# Altium schematic sheet EIT_Teensy_DDS.SchDoc
size A
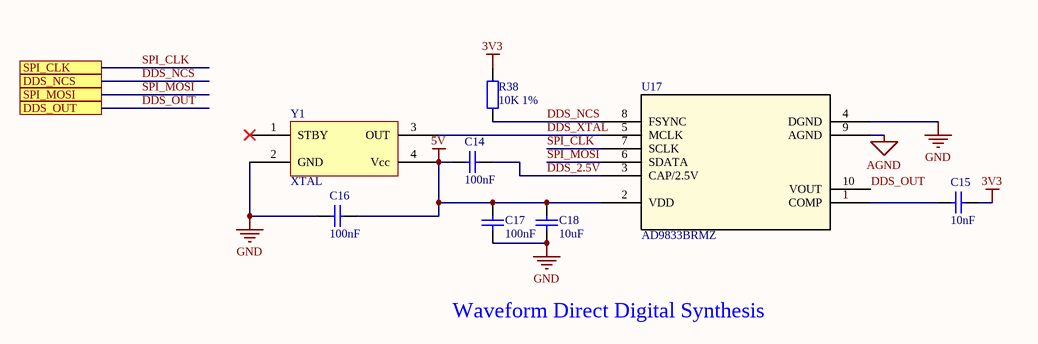
[diagram p0: EIT_Teensy_DDS.SchDoc]

## Parts
C14  100nF  [0603 CAP]
C15  10nF  [0603 CAP]
C16  100nF  [0603 CAP]
C17  100nF  [0603 CAP]
C18  10uF  [0603 CAP]
R38  10K 1%  [0603 RES]
U17  AD9833BRMZ  [RM_10_ADI]
Y1  XTAL  [XTAL SMD]

## Ports
DDS_NCS, DDS_OUT, SPI_CLK, SPI_MOSI

## Nets
3V3: C15.2 R38.2
5V: C14.1 C16.1 C17.2 C18.2 U17.2(VDD) Y1.4(Vcc)
AGND: U17.9(AGND)
GND: C16.2 C17.1 C18.1 U17.4(DGND) Y1.2(GND)
DDS_2.5V: C14.2 U17.3(CAP/2.5V)
DDS_NCS: R38.1 U17.8(FSYNC) ; port DDS_NCS
DDS_OUT: U17.10(VOUT) ; port DDS_OUT
DDS_XTAL: U17.5(MCLK) Y1.3(OUT)
SPI_CLK: U17.7(SCLK) ; port SPI_CLK
SPI_MOSI: U17.6(SDATA) ; port SPI_MOSI
NetC15_1: C15.1 U17.1(COMP)

Not connected (* = marked no-connect by the designer): Y1 1(STBY)*

## Notes on the sheet
- Waveform Direct Digital Synthesis

## Library data of the parts
C14 C16 C17 = Cap 0603 100nF 10% 50V: Multi Layer Ceramic Capacitor (MLCC) / Cap Ceramic 0.1uF 50V X7R 10% Pad SMD 0603 125¡ãC T/R; Manufacturer: Samsung; Manufacturer Part Number: CL10B104KB8NNNC; Supplier 1: Digi-Key; RoHS: Yes; Category: Ceramic Capacitors; Stock 1: 16186368; Pricing 1: 1=0.10000, 10=0.03000, 50=0.01620, 100=0.01330, 500=0.00950, 1000=0.00746 (USD); Mount: Surface Mount; Case/Package: 0603; Case Code (Metric): 1608; Case Code (Imperial): 0603; Material: Ceramic; Contact Plating: Tin; Min Operating Temperature: -55°C; Max Operating Temperature: 125°C; Tolerance: 10%; Package Quantity: 1; Packaging: Tape and Reel; Capacitance: 100nF; Dielectric: X7R; Series: CL; Voltage Rating: 50V; Voltage: 50V; Voltage Rating (DC): 50V; Construction: Flat; Length: 1.6mm; Width: 0.031inch; Height: 0.8mm; Depth: 0.8mm; Thickness: 0.035inch; Radiation Hardening: No; Lead Free: Lead Free; RoHS Compliant: Yes; ComponentLink1URL: https://datasheet.ciiva.com/25803/cl10b104kb8nnnc-25803393.pdf?src-supplier=Digi-Key; ComponentLink1Description: https://datasheet.ciiva.com/25803/cl10b104kb8nnnc-25803393.pdf?src-supplier=Digi-Key; ComponentLink2URL: https://datasheet.ciiva.com/26838/getdatasheetpartid-89097-26838411.pdf?src-supplier=Verical; ComponentLink2Description: https://datasheet.ciiva.com/26838/getdatasheetpartid-89097-26838411.pdf?src-supplier=Verical; ComponentLink3URL: https://datasheet.ciiva.com/29198/456651-da-01-en-vs-kondensator-0605-29198839.pdf?src-supplier=Conrad; ComponentLink3Description: https://datasheet.ciiva.com/29198/456651-da-01-en-vs-kondensator-0605-29198839.pdf?src-supplier=Conrad; Supplier Part Number 1: 1276-1000-1-ND
C15 = Cap 0603 10nF 10% 50V: CAP CER 10000PF 50V X7R 0603; Manufacturer: Samsung; Manufacturer Part Number: CL10B103KB8NFNC; Tolerance: 10%; Supplier 1: Digi-Key; RoHS: Yes; Category: Ceramic Capacitors; Stock 1: 172215; Pricing 1: 1=0.10000, 10=0.03700, 50=0.02020, 100=0.01650, 500=0.01176, 1000=0.00923 (USD); Mount: Surface Mount; Case/Package: 0603; Case Code (Metric): 1608; Case Code (Imperial): 0603; Contact Plating: Tin,Matte; Min Operating Temperature: -55°C; Max Operating Temperature: 125°C; Capacitance: 10nF; Dielectric: X7R; Voltage Rating: 50V; Packaging: Tape and Reel; Series: CL; Construction: Flat; Length: 0.063inch; Width: 0.031inch; Height: 0.8mm; Depth: 0.8mm; Thickness: 0.035inch; Radiation Hardening: No; ComponentLink1URL: https://datasheet.ciiva.com/25712/cl10b103kb8nfnc-25712209.pdf?src-supplier=Digi-Key; ComponentLink1Description: https://datasheet.ciiva.com/25712/cl10b103kb8nfnc-25712209.pdf?src-supplier=Digi-Key; Supplier Part Number 1: 1276-1922-1-ND; RoHS Compliant: Yes
C18 = Cap 0603 10uF 10% 25V: 0603 10 uF 25 V ±20 % Tolerance X5R Surface Mount Multilayer Ceramic Capacitor; Manufacturer: Murata; Manufacturer Part Number: GRT188R61E106ME13D; Voltage Rating: 25V; Tolerance: 20%; Supplier 1: Digi-Key; RoHS: No; Category: Ceramic Capacitors; Stock 1: 290939; Pricing 1: 1=0.53000, 10=0.36700, 50=0.25660, 100=0.22000, 500=0.16498, 1000=0.13932 (USD); Case/Package: 0603; RoHS Compliant: No; ComponentLink1URL: https://search.murata.co.jp/Ceramy/image/img/A01X/G101/ENG/GRT188R61E106ME13-01.pdf?src-supplier=Digi-Key; ComponentLink1Description: https://search.murata.co.jp/Ceramy/image/img/A01X/G101/ENG/GRT188R61E106ME13-01.pdf?src-supplier=Digi-Key; Supplier Part Number 1: 490-12323-1-ND; Mount: Surface Mount; Case Code (Metric): 1608; Case Code (Imperial): 0603; Min Operating Temperature: -55°C; Max Operating Temperature: 85°C; Packaging: Tape and Reel; Capacitance: 10uF; Length: 0.063inch; Width: 0.031inch; Thickness: 0.035inch; Ratings: AEC-Q200; ComponentLink2URL: http://search.murata.co.jp/Ceramy/image/img/A01X/G101/ENG/GRT188R61E106ME13-01.pdf?src-supplier=Digi-Key; ComponentLink2Description: http://search.murata.co.jp/Ceramy/image/img/A01X/G101/ENG/GRT188R61E106ME13-01.pdf?src-supplier=Digi-Key
R38 = Res 0603 10K 1%: Res General Purpose Thick Film 0603 10K Ohm 1% 1/10W ±100ppm/°C Molded SMD Paper T/R; Manufacturer: Yageo; Manufacturer Part Number: RC0603FR-0710KL; Voltage Rating: 75V; Resistance: 10kR; Power Rating: 100mW; Voltage Rating (DC): 50V; Supplier 1: Digi-Key; RoHS: Yes; Category: Chip SMD Resistors; Stock 1: 18430741; Pricing 1: 1=0.10000, 10=0.02400, 100=0.00970, 1000=0.00436, 2500=0.00378 (USD); Case/Package: 0603; Number of Pins: 2; Case Code (Imperial): 0603; Case Code (Metric): 1608; Size Code: 0603; Weight: 7.1E-05oz; Min Operating Temperature: -55°C; Max Operating Temperature: 155°C; Packaging: Tape and Reel; Tolerance: 1%; Termination: SMD/SMT; Resistor Type: Thick Film; Temperature Coefficient: 100ppm/°C; Features: Moisture Resistant; Series: RC; Max Power Dissipation: 100mW; Number of Terminations: 2; Resistance Tolerance: 1%; Construction: Rectangular; Length: 1.6mm; Width: 0.8mm; Height: 0.45mm; Depth: 0.8mm; Lead Pitch: 0.3mm; REACH SVHC: Unknown; Military Standard: Not; Lead Free: Lead Free; RoHS Compliant: Yes; ComponentLink1URL: https://datasheet.ciiva.com/15189/getdatasheetpartid-409289-15189591.pdf?src-supplier=Verical; ComponentLink1Description: https://datasheet.ciiva.com/15189/getdatasheetpartid-409289-15189591.pdf?src-supplier=Verical; ComponentLink2URL: https://datasheet.ciiva.com/7660/38590-7660789.pdf?src-supplier=Element14; ComponentLink2Description: https://datasheet.ciiva.com/7660/38590-7660789.pdf?src-supplier=Element14; ComponentLink3URL: https://datasheet.ciiva.com/7746/1738695-7746239.pdf?src-supplier=Element14; ComponentLink3Description: https://datasheet.ciiva.com/7746/1738695-7746239.pdf?src-supplier=Element14; ComponentLink4URL: https://datasheet.ciiva.com/7983/443971-7983596.pdf?src-supplier=Element14; ComponentLink4Description: https://datasheet.ciiva.com/7983/443971-7983596.pdf?src-supplier=Element14; ComponentLink5URL: https://datasheet.ciiva.com/22747/443971-22747519.pdf?src-supplier=Element14; ComponentLink5Description: https://datasheet.ciiva.com/22747/443971-22747519.pdf?src-supplier=Element14; ComponentLink6URL: https://datasheet.ciiva.com/46440/1868787-46440891.pdf?src-supplier=Element14; ComponentLink6Description: https://datasheet.ciiva.com/46440/1868787-46440891.pdf?src-supplier=Element14; Supplier Part Number 1: 311-10.0KHRCT-ND
U17 = AD9833BRMZ: Direct Digital Synthesizer 25MHz 1-DAC 10-Bit Serial 10-Pin MSOP T/R; Manufacturer: Analog Devices; Manufacturer Part Number: AD9833BRMZ-REEL; Min Supply Voltage: 2.3V; Max Supply Voltage: 5.5V; Resolution: 10b; Number of Converters: 1; Signal to Noise Ratio (SNR): 60dB; Power Dissipation: 27.5mW; Nominal Supply Current: 5.5mA; Number of Bits: 10; Nominal Output Voltage: 650mV; Output Type: Voltage; Supplier 1: Digi-Key; RoHS: Yes; Category: Integrated Circuits (ICs); Stock 1: 963; Pricing 1: 1=10.65000, 10=9.61700, 25=9.17000, 100=7.96230, 250=7.60444, 500=6.93346, 1000=6.33000 (USD); Mount: Surface Mount; Case/Package: MSOP; Number of Pins: 10; Contact Plating: Tin,Matte; Min Operating Temperature: -40°C; Max Operating Temperature: 105°C; Packaging: Tape and Reel; Package Quantity: 3000; Number of Outputs: 1; Number of D/A Converters: 1; Max Supply Current: 5.5mA; Frequency: 25MHz; Operating Supply Current: 5.5mA; Series: -; Lead Free: Contains Lead; RoHS Compliant: Yes; ComponentLink1URL: https://datasheet.ciiva.com/26828/ad9833brmz-reel-26828130.pdf?src-supplier=IIIC; ComponentLink1Description: https://datasheet.ciiva.com/26828/ad9833brmz-reel-26828130.pdf?src-supplier=IIIC; ComponentLink2URL: https://datasheet.ciiva.com/3177/ad9833-3177366.pdf?src-supplier=Avnet; ComponentLink2Description: https://datasheet.ciiva.com/3177/ad9833-3177366.pdf?src-supplier=Avnet; ComponentLink3URL: https://datasheet.ciiva.com/25889/ad9833-25889575.pdf?src-supplier=Avnet+Europe; ComponentLink3Description: https://datasheet.ciiva.com/25889/ad9833-25889575.pdf?src-supplier=Avnet+Europe; Supplier Part Number 1: AD9833BRMZ-REELCT-ND
Y1 = XTAL 16MHz 5V SMD: CRYSTAL, 16MHZ, 18PF, 5 X 3.2MM; Product Range:ABM3B Series; Frequency Nom:16MHz; Frequency Stability + / -:50ppm; Frequency Tolerance + / -:20ppm; Crystal Case:SMD, 5mm x 3.2mm; Load Capacitance:18pF; Operating Temperature Min:-20 C;RoHS Compliant: Yes; Manufacturer: Abracon; Manufacturer Part Number: ABM3B-16.000MHZ-B2-T; ESR (Equivalent Series Resistance): 50R; Tolerance: 20ppm; Frequency Stability: 50ppm; Supplier 1: Digi-Key; RoHS: Yes; Category: Crystals; Stock 1: 37377; Pricing 1: 1=0.95000, 10=0.83900, 50=0.78440, 100=0.69310, 500=0.65664 (USD); Mount: Surface Mount; Case/Package: CSMD; Number of Pins: 4; Min Operating Temperature: -20°C; Max Operating Temperature: 70°C; Frequency: 16MHz; Load Capacitance: 18pF; Packaging: Tape and Reel; Package Quantity: 1000; Frequency Tolerance: 20ppm; Termination: SMD/SMT; Resistor Type: Ceramic; Accuracy: 20ppm; Series: ABM3B; Operating Frequency: 16 MHz; Length: 5mm; Width: 3.2mm; Height: 0.043inch; Depth: 3.2mm; REACH SVHC: No SVHC; Lead Free: Lead Free; ComponentLink1URL: https://datasheet.ciiva.com/855/abm3b-855719.pdf?src-supplier=Digi-Key; ComponentLink1Description: https://datasheet.ciiva.com/855/abm3b-855719.pdf?src-supplier=Digi-Key; ComponentLink2URL: https://datasheet.ciiva.com/855/abm3b-855720.pdf?src-supplier=Digi-Key; ComponentLink2Description: https://datasheet.ciiva.com/855/abm3b-855720.pdf?src-supplier=Digi-Key; ComponentLink3URL: https://datasheet.ciiva.com/855/abm3b-855721.pdf?src-supplier=Digi-Key; ComponentLink3Description: https://datasheet.ciiva.com/855/abm3b-855721.pdf?src-supplier=Digi-Key; ComponentLink4URL: https://datasheet.ciiva.com/3175/abm3b-3175822.pdf?src-supplier=Avnet; ComponentLink4Description: https://datasheet.ciiva.com/3175/abm3b-3175822.pdf?src-supplier=Avnet; ComponentLink5URL: https://datasheet.ciiva.com/16410/abm3b-16410983.pdf?src-supplier=Future+Electronics; ComponentLink5Description: https://datasheet.ciiva.com/16410/abm3b-16410983.pdf?src-supplier=Future+Electronics; ComponentLink6URL: https://datasheet.ciiva.com/7998/1883675-7998599.pdf?src-supplier=Element14; ComponentLink6Description: https://datasheet.ciiva.com/7998/1883675-7998599.pdf?src-supplier=Element14; Supplier Part Number 1: 535-9122-1-ND